# Altium schematic sheet VGA.SchDoc
size A4
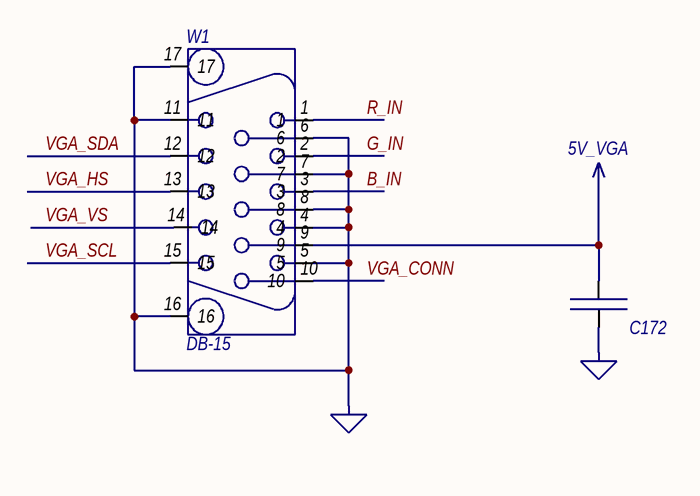
[diagram p0: VGA.SchDoc]

## Parts
C172  *  [Cap_tantal_D]  (value not drawn)
W1  DB-15  [VGA]

## Nets
5V_VGA: C172.2 W1.9
GND: C172.1 W1.4 W1.5 W1.6 W1.7 W1.8 W1.11 W1.16 W1.17
B_IN: W1.3
G_IN: W1.2
R_IN: W1.1
VGA_CONN: W1.10
VGA_HS: W1.13
VGA_SCL: W1.15
VGA_SDA: W1.12
VGA_VS: W1.14

## Library data of the parts
C172 = Capacitor
W1 = VGA_connector